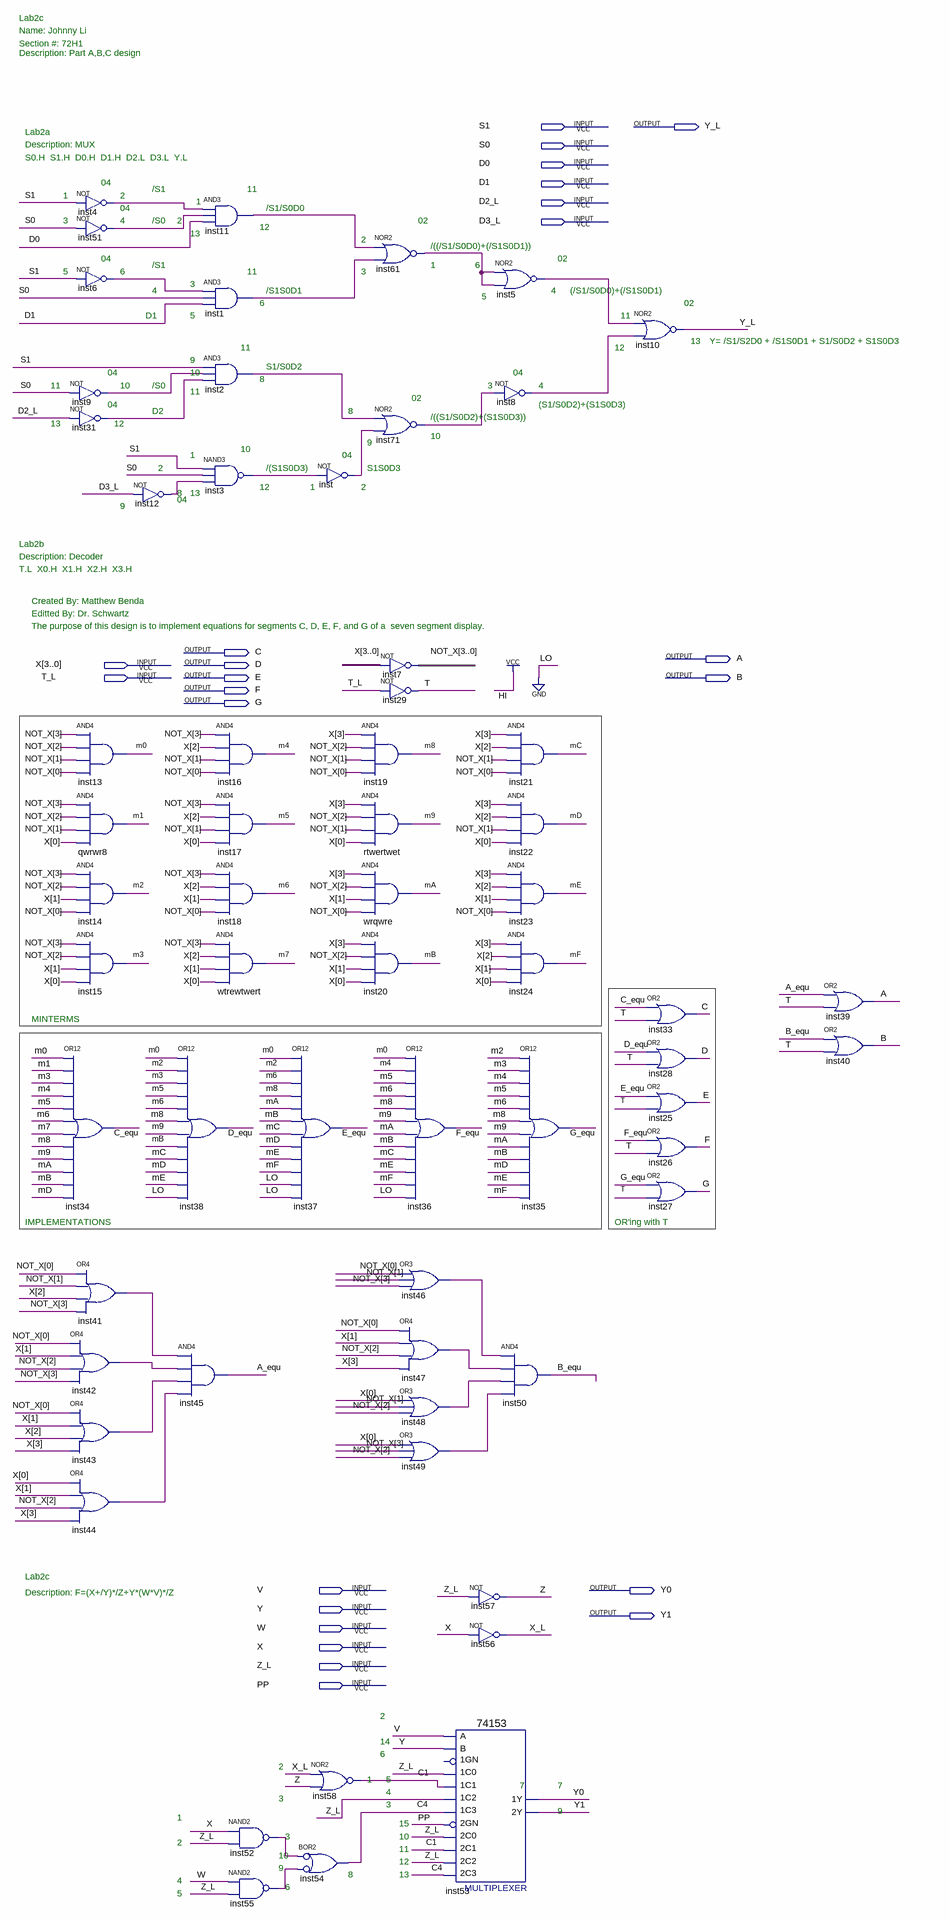
[diagram p0: schematic sheet]
// Quartus schematic lab2_ALL.bdf as structural Verilog: 63 symbols, 24 pins
module lab2_ALL (
  input  S1,
  input  S0,
  input  D0,
  input  D1,
  input  D2_L,
  input  D3_L,
  input  [3:0] X,
  input  T_L,
  input  V,
  input  Y,
  input  W,
  input  X_1bit,
  input  Z_L,
  input  PP,
  output Y_L,
  output C,
  output A,
  output D,
  output E,
  output B,
  output F,
  output G,
  output Y0,
  output Y1
);

  wire A_equ, B_equ, C1, C4, C_equ, D_equ, E_equ, F_equ, G_equ, inst1_out, inst2_out, inst3_out, inst4_out,
       inst5_out, inst6_out, inst8_out, inst9_out, inst11_out, inst12_out, inst31_out, inst41_out,
       inst42_out, inst43_out, inst44_out, inst46_out, inst47_out, inst48_out, inst49_out, inst51_out,
       inst52_out, inst55_out, inst61_out, inst71_out, inst_out, m0, m1, m2, m3, m4, m5, m6, m7, m8, m9, mA,
       mB, mC, mD, mE, mF, T, X_L, Z;
  wire [3:0] NOT_X;

  not inst4 (inst4_out, S1);
  not inst51 (inst51_out, S0);
  not inst6 (inst6_out, S1);
  not inst9 (inst9_out, S0);
  not inst31 (inst31_out, D2_L);
  and inst13 (m0, NOT_X[3], NOT_X[2], NOT_X[1], NOT_X[0]);
  and qwrwr8 (m1, NOT_X[3], NOT_X[2], NOT_X[1], X[0]);
  and inst14 (m2, NOT_X[3], NOT_X[2], X[1], NOT_X[0]);
  and inst15 (m3, NOT_X[3], NOT_X[2], X[1], X[0]);
  or inst34 (C_equ, m0, m1, m3, m4, m5, m6, m7, m8, m9, mA, mB, mD);
  or inst41 (inst41_out, NOT_X[0], NOT_X[1], X[2], NOT_X[3]);
  or inst42 (inst42_out, NOT_X[0], X[1], NOT_X[2], NOT_X[3]);
  or inst43 (inst43_out, NOT_X[0], X[1], X[2], X[3]);
  or inst44 (inst44_out, X[0], X[1], NOT_X[2], X[3]);
  not inst12 (inst12_out, D3_L);
  or inst38 (D_equ, m0, m2, m3, m5, m6, m8, m9, mB, mC, mD, mE, 1'b0);
  and inst45 (A_equ, inst41_out, inst42_out, inst43_out, inst44_out);
  and inst11 (inst11_out, inst4_out, inst51_out, D0);
  and inst1 (inst1_out, inst6_out, S0, D1);
  and inst2 (inst2_out, S1, inst9_out, inst31_out);
  nand inst3 (inst3_out, S1, S0, inst12_out);
  and inst16 (m4, NOT_X[3], X[2], NOT_X[1], NOT_X[0]);
  and inst17 (m5, NOT_X[3], X[2], NOT_X[1], X[0]);
  and inst18 (m6, NOT_X[3], X[2], X[1], NOT_X[0]);
  and wtrewtwert (m7, NOT_X[3], X[2], X[1], X[0]);
  nand inst52 (inst52_out, X_1bit, Z_L);
  nand inst55 (inst55_out, W, Z_L);
  not inst (inst_out, inst3_out);
  or inst37 (E_equ, m0, m2, m6, m8, mA, mB, mC, mD, mE, mF, 1'b0, 1'b0);
  nor inst58 (C1, X_L, Z);
  or inst54 (C4, ~inst52_out, ~inst55_out);  // BOR2
  nor inst61 (inst61_out, inst11_out, inst1_out);
  nor inst71 (inst71_out, inst2_out, inst_out);
  assign NOT_X = ~X;  // NOT inst7, 4 bits wide
  not inst29 (T, T_L);
  and inst19 (m8, X[3], NOT_X[2], NOT_X[1], NOT_X[0]);
  and rtwertwet (m9, X[3], NOT_X[2], NOT_X[1], X[0]);
  and wrqwre (mA, X[3], NOT_X[2], X[1], NOT_X[0]);
  and inst20 (mB, X[3], NOT_X[2], X[1], X[0]);
  or inst36 (F_equ, m0, m4, m5, m6, m8, m9, mA, mB, mC, mE, mF, 1'b0);
  or inst46 (inst46_out, NOT_X[0], NOT_X[1], NOT_X[3]);
  or inst47 (inst47_out, NOT_X[0], X[1], NOT_X[2], X[3]);
  or inst48 (inst48_out, X[0], NOT_X[1], NOT_X[2]);
  or inst49 (inst49_out, X[0], NOT_X[3], NOT_X[2]);
  not inst57 (Z, Z_L);
  not inst56 (X_L, X_1bit);
  \74153  inst53 (
    .\1C1 (C1), .\1C0 (Z_L), .\2C0 (Z_L), .\2GN (PP), .\2C2 (Z_L), .\1C2 (Z_L), .\1C3 (C4), .B(Y), .A(V),
    .\2C1 (C1), .\2C3 (C4), .\1Y (Y0), .\2Y (Y1));  // open: 1GN
  nor inst5 (inst5_out, inst61_out, inst61_out);
  not inst8 (inst8_out, inst71_out);
  and inst21 (mC, X[3], X[2], NOT_X[1], NOT_X[0]);
  and inst22 (mD, X[3], X[2], NOT_X[1], X[0]);
  and inst23 (mE, X[3], X[2], X[1], NOT_X[0]);
  and inst24 (mF, X[3], X[2], X[1], X[0]);
  or inst35 (G_equ, m2, m3, m4, m5, m6, m8, m9, mA, mB, mD, mE, mF);
  and inst50 (B_equ, inst46_out, inst47_out, inst48_out, inst49_out);
  nor inst10 (Y_L, inst5_out, inst8_out);
  or inst33 (C, C_equ, T);
  or inst28 (D, D_equ, T);
  or inst25 (E, E_equ, T);
  or inst26 (F, F_equ, T);
  or inst27 (G, G_equ, T);
  or inst39 (A, A_equ, T);
  or inst40 (B, B_equ, T);

  // Notes on the sheet:
  //   Lab2c
  //   Name: Johnny Li
  //   Section #: 72H1
  //   Description: Part A,B,C design
  //   Lab2a
  //   Description: MUX
  //   S0.H  S1.H  D0.H  D1.H  D2.L  D3.L  Y.L
  //   04
  //   /S1
  //   11
  //   1
  //   2
  //   1
  //   04
  //   /S1/S0D0
  //   3
  //   4
  //   /S0
  //   2
  //   02
  //   12
  //   13
  //   2
  //   /((/S1/S0D0)+(/S1S0D1))
  //   04
  //   02
  //   /S1
  //   1
  //   6
  //   5
  //   6
  //   11
  //   3
  //   3
  //   4
  //   /S1S0D1
  //   4
  //   (/S1/S0D0)+(/S1S0D1)
  //   5
  //   6
  //   02
  //   D1
  //   5
  //   11
  //   13
  //   Y= /S1/S2D0 + /S1S0D1 + S1/S0D2 + S1S0D3
  //   11
  //   12
  //   9
  //   S1/S0D2
  //   04
  //   10
  //   04
  //   8
  //   11
  //   10
  //   /S0
  //   3
  //   4
  //   11
  //   02
  //   04
  //   (S1/S0D2)+(S1S0D3)
  //   D2
  //   8
  //   /((S1/S0D2)+(S1S0D3))
  //   13
  //   12
  //   10
  //   9
  //   10
  //   1
  //   04
  //   2
  //   /(S1S0D3)
  //   S1S0D3
  //   12
  //   1
  //   2
  //   8
  //   13
  //   04
  //   9
  //   Lab2b
  //   Description: Decoder
  //   T.L  X0.H  X1.H  X2.H  X3.H
  //   Created By: Matthew Benda
  //   Editted By: Dr. Schwartz
  //   The purpose of this design is to implement equations for segments C, D, E, F, and G of a  seven segment display.            
  //   MINTERMS
  //   IMPLEMENTATIONS
  //   OR'ing with T
  //   Lab2c
  //   Description: F=(X+/Y)*/Z+Y*(W*V)*/Z
  //   2
  //   14
  //   6
  //   2
  //   1
  //   5
  //   7
  //   7
  //   4
  //   3
  //   3
  //   9
  //   1
  //   15
  //   3
  //   10
  //   2
  //   11
  //   10
  //   12
  //   9
  //   8
  //   13
  //   4
  //   6
  //   5
endmodule
